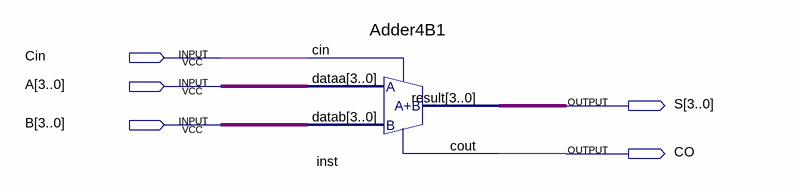
[diagram p0: schematic sheet]
// Quartus schematic adder4-B.bdf as structural Verilog: 1 symbols, 5 pins
module \adder4-B  (
  input  Cin,
  input  [3:0] A,
  input  [3:0] B,
  output [3:0] S,
  output CO
);

  Adder4B1 inst (.dataa(A), .datab(B), .cin(Cin), .result(S), .cout(CO));
endmodule
